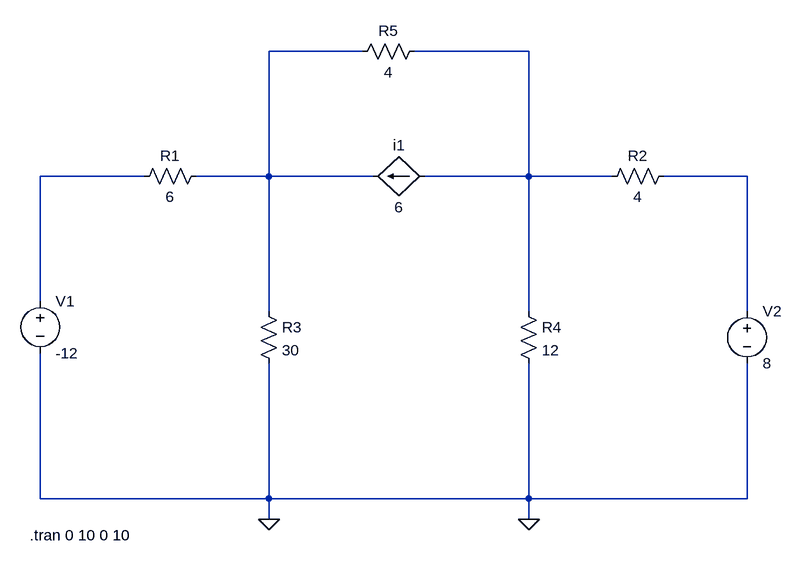
[diagram p0: schematic questão3.asc]
questão3.asc, the LTspice schematic file:
Version 4
SHEET 1 1208 728
WIRE 384 -32 240 -32
WIRE 640 -32 464 -32
WIRE 48 160 -112 160
WIRE 240 160 240 -32
WIRE 240 160 128 160
WIRE 400 160 240 160
WIRE 640 160 640 -32
WIRE 640 160 480 160
WIRE 768 160 640 160
WIRE 976 160 848 160
WIRE -112 352 -112 160
WIRE 240 368 240 160
WIRE 640 368 640 160
WIRE 976 368 976 160
WIRE -112 656 -112 432
WIRE 240 656 240 448
WIRE 240 656 -112 656
WIRE 640 656 640 448
WIRE 640 656 240 656
WIRE 976 656 976 448
WIRE 976 656 640 656
WIRE 240 688 240 656
WIRE 640 688 640 656
FLAG 240 688 0
FLAG 640 688 0
DATAFLAG 528 160 "$-V(N001)"
DATAFLAG 528 -32 "$-V(N001)"
DATAFLAG 912 160 "$-V(N002)"
SYMBOL res 32 176 R270
WINDOW 0 32 56 VTop 2
WINDOW 3 0 56 VBottom 2
SYMATTR InstName R1
SYMATTR Value 6
SYMBOL res 864 144 R90
WINDOW 0 0 56 VBottom 2
WINDOW 3 32 56 VTop 2
SYMATTR InstName R2
SYMATTR Value 4
SYMBOL res 224 352 R0
SYMATTR InstName R3
SYMATTR Value 30
SYMBOL res 624 352 R0
SYMATTR InstName R4
SYMATTR Value 12
SYMBOL res 368 -16 R270
WINDOW 0 32 56 VTop 2
WINDOW 3 0 56 VBottom 2
SYMATTR InstName R5
SYMATTR Value 4
SYMBOL bi 480 160 R90
WINDOW 0 -32 40 VBottom 2
WINDOW 3 32 40 VTop 2
SYMATTR InstName i1
SYMATTR Value 6
SYMATTR Prefix i
SYMBOL voltage -112 336 R0
WINDOW 123 0 0 Left 0
WINDOW 39 0 0 Left 0
SYMATTR InstName V1
SYMATTR Value -12
SYMBOL voltage 976 352 R0
WINDOW 123 0 0 Left 0
WINDOW 39 0 0 Left 0
SYMATTR InstName V2
SYMATTR Value 8
TEXT -128 712 Left 2 !.tran 0 10 0 10

The netlist it stands for:
* questão3.asc
R1 N003 N001 6
R2 N004 N002 4
R3 N001 0 30
R4 N002 0 12
R5 N001 N002 4
i1 N002 N001 6
V1 N003 0 -12
V2 N004 0 8
.tran 0 10 0 10
.backanno
.end